# Altium schematic sheet Power.SchDoc
size A4
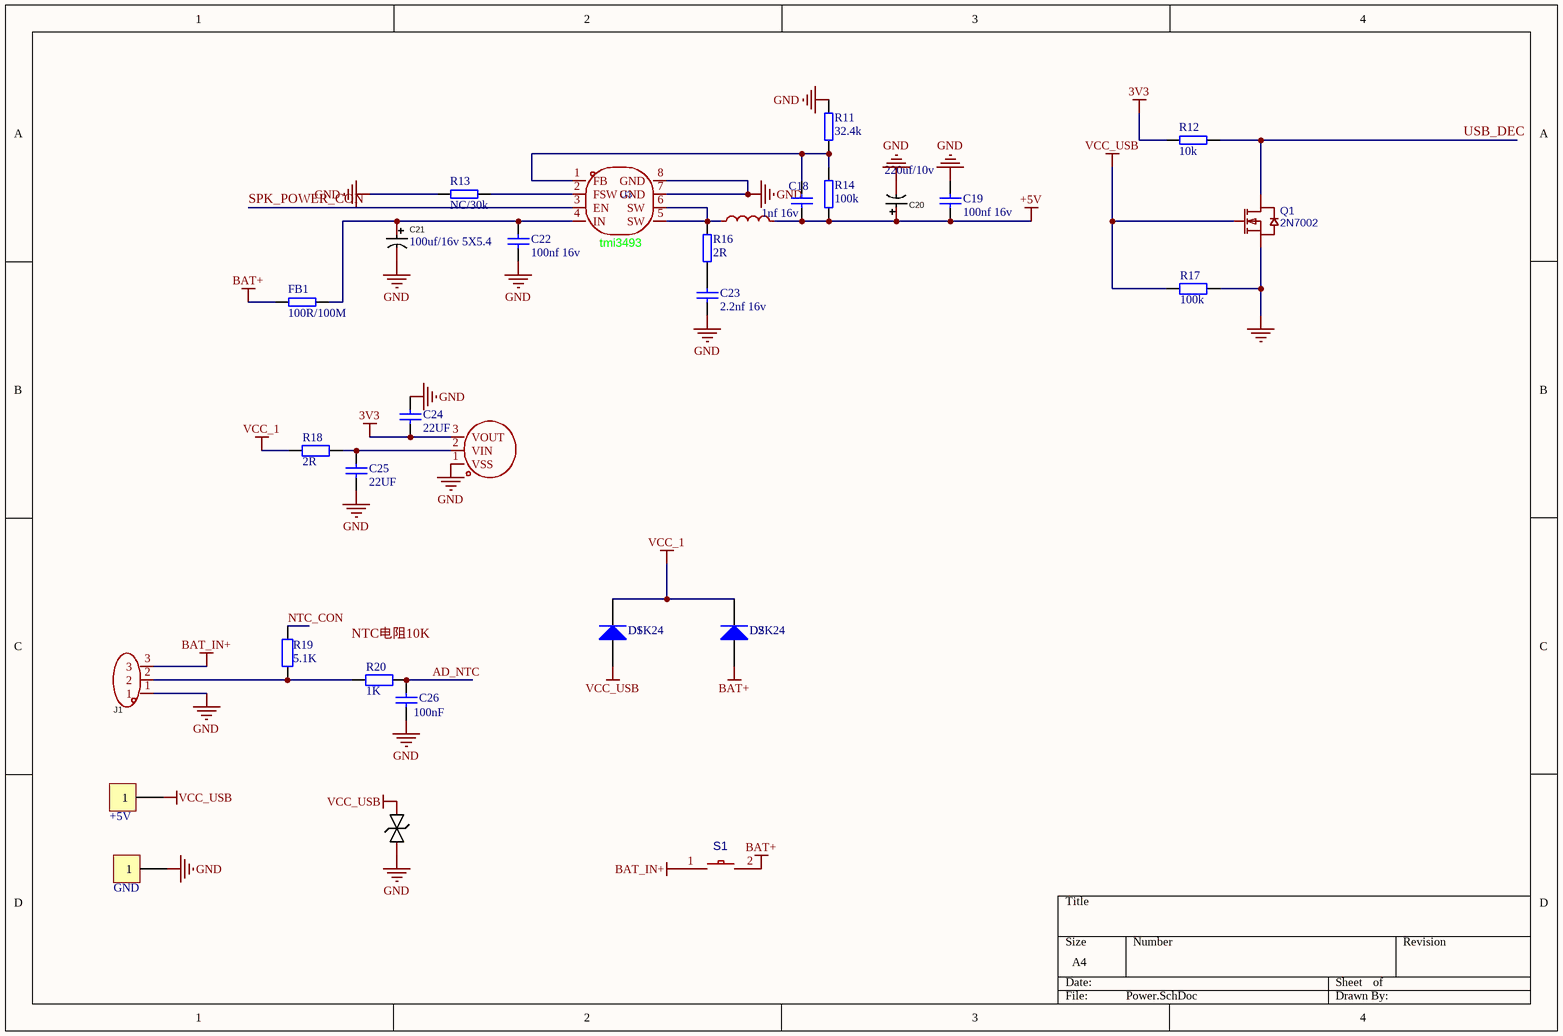
[diagram p0: Power.SchDoc]

## Parts
C18  1nf 16v  [0603_C]
C19  100nf 16v  [0603_C]
C20  220uf/10v  [SMD 6.3*7.7]
C21  100uf/16v 5X5.4  [CAP-SMD_5*5.4]
C22  100nf 16v  [0603_C]
C23  2.2nf 16v  [0603_C]
C24  22UF  [0805_C]
C25  22UF  [0805_C]
C26  100nF  [0603_C]
D1  DSK24  [SOD-123FL]
D2  DSK24  [SOD-123FL]
D3  SMF6.0CA  [SOD-123 双向]  (value not drawn)
FB1  100R/100M  [0805_R]
J1  3.96-3P LT  [CONN-SMD_3.96-3P-LT]  (value not drawn)
L3  33uh 0650  [IND-SMD_L7.7-W6.6_APS0650]  (value not drawn)
P1  +5V  [PAD2]
P2  GND  [PAD2]
Q1  2N7002  [SOT-23]
R11  32.4k  [0603_R]
R12  10k  [0603_R]
R13  NC/30k  [0603_R]
R14  100k  [0603_R]
R16  2R  [0603_R]
R17  100k  [0603_r]
R18  2R  [0805_R]
R19  5.1K  [0603_R]
R20  1K  [0603_R]
S1  *  [大按键]  (value not drawn)
U3  tmi3493  [SOP8]
U4  HT7333-1-MS  [SOT-89]  (value not drawn)

## Nets
3V3: C24.1 R12.1 U4.3(VOUT)
+5V: C18.1 C19.1 C20.1 L3.2 R14.2
BAT+: D2.1(A) FB1.2 S1.2
BAT_IN+: J1.3 S1.1
GND: C19.2 C20.2 C21.2 C22.2 C23.2 C24.2 C25.1 C26.1 D3.1 J1.1 P2.1 Q1.2(S) R11.1 R13.2 R17.1 U3.7(GND) U3.8(GND) U4.1(VSS)
VCC_1: D1.2(K) D2.2(K) R18.1
VCC_USB: D1.1(A) D3.2 P1.1 Q1.1(G) R17.2
AD_NTC: C26.2 R20.2
NTC_CON: R19.1
SPK_POWER_CON: U3.3(EN)
USB_DEC: Q1.3(D) R12.2
NetC18_2: C18.2 R11.2 R14.1 U3.1(FB)
NetC21_1: C21.1 C22.1 FB1.1 U3.4(IN)
NetC23_1: C23.1 R16.2
NetC25_2: C25.2 R18.2 U4.2(VIN)
NetJ1_2: J1.2 R19.2 R20.1
NetL3_1: L3.1 R16.1 U3.5(SW) U3.6(SW)
NetR13_1: R13.1 U3.2(FSW)

## Notes on the sheet
- Labels drawn without touching a wire or pin: NTC电阻10K

## Library data of the parts
C18 C19 C22 C23 = Cap: Capacitor; Value: 10nF; Published: 8-Jun-2000; Revision: July-2002: Re-released for DXP Platform.; Publisher: Altium Limited
C20 C21 = RVT1A221M0605_C72494: Symbol: RVT1A221M0605-C72494; Value: 220uF; Add into BOM: yes; Rated Voltage: 10V; Ripple Current: 90mA@120Hz; L: 5.4mm; Device: RVT1A221M0605_C72494; Supplier: LCSC; Manufacturer Part: RVT1A221M0605; Supplier Part: C72494; JLCPCB Part Class: Extended Part; Supplier Footprint: SMD,D6.3xL5.4mm; Datasheet: https://atta.szlcsc.com/upload/public/pdf/source/20170325/1490427950282.pdf; Convert to PCB: yes; Equivalent Series Resistance(ESR): -
C24-C26 = CAP
D1 D2 = Diode 1N4148: High Conductance Fast Diode; Published: 8-Jun-2000; LatestRevisionDate: 17-Jul-2002; LatestRevisionNote: Re-released for DXP Platform.; DatasheetVersion: 1997; PackageReference: DO-35; Publisher: Altium Limited; PackageDescription: Diode, Axial; Body 3.8 x 1.9 mm (LxDia. max), Lead Dia. 0.53 mm (max); Code_JEDEC: DO-204-AH; ComponentLink1Description: Manufacturer Link; ComponentLink1URL: http://www.fairchildsemi.com/; ComponentLink2Description: Datasheet; ComponentLink2URL: http://www.fairchildsemi.com/ds/1N%2F1N4148.pdf
D3 = SMF5.0CA_C726939: Add into BOM: yes; Symbol: SMF5.0CA_C726939; Device: SMF5.0CA_C726939; Supplier: LCSC; Supplier Part: C726939; Manufacturer Part: SMF5.0CA; JLCPCB Part Class: Extended Part; LCSC Part Name: SMF5.0CA; Supplier Footprint: SOD-123FL; Datasheet: https://atta.szlcsc.com/upload/public/pdf/source/20200825/C726891_B615A55314C94A3B16B7FBCD32D40567.pdf; Convert to PCB: yes
FB1 R11-R14 R16 = RES
J1 = BX-PH2.0-3PZZ: Add into BOM: yes; Pins Structure: 1x3P; Pitch: 2mm; Reference Series: PH; Number of PINs Per Row: 3; Current Rating (Max): 2A; Symbol: BX-PH2.0-3PZZ; Device: BX-PH2.0-3PZZ; LCSC Part Name: BX-PH2.0-3PZZ; Supplier Part: C18077745; Manufacturer Part: BX-PH2.0-3PZZ; JLCPCB Part Class: Extended Part; Datasheet: https://atta.szlcsc.com/upload/public/pdf/source/20231017/78B49E88B01779D5C268ECAB29020769.pdf; Supplier: LCSC; Convert to PCB: yes; Number of Pins: 3P; Number of Rows: 1; Row Spacing: -; Comment_1: BX-PH2.0-3PZZ
L3 = yspi0518s-100m: AddInBom: yes; ModelId: 8cf4ba96105a43709c0ba3ecbf611559; ModelName: IND-SMD_L5.4-W5.2-H3.0; ModelTransform: 212.598,204.728,0,0,0,0,0,0,0; Value: 10uH; Current Rating: 2.5A; Current - Saturation(Isat): 3A; Symbol: YSPI0518S-100M; SupplierPart: C46595828; ManufacturerPart: YSPI0518S-100M; Supplier Footprint: SMD,5.4x5.2mm; Datasheet: https://item.szlcsc.com/datasheet/YSPI0518S-100M/48734898.html; Supplier: LCSC; ConvertToPcb: yes; FootprintName: IND-SMD_L5.4-W5.2
P1 P2 = CON1
Q1 = JMTL3400A: Contributor: LCSC; BOM_Supplier: LCSC; BOM_Supplier Part: C2890442; BOM_Manufacturer Part: JMTL3400A; BOM_JLCPCB Part Class: Extended Part; spicePre: Q; spiceSymbolName: JMTL3400A
R17-R20 = Res1: 贴片电阻
S1 = TS-3625SP-2P: Symbol: TS-3625SP-2P
U3 = tmi3493: AddInBom: yes; ModelId: 75c24a7891ee4dd6bdac16a7163ff87e; ModelName: SOP-8_L4.9-W3.9-P1.27-LS6.0-BL-1; ModelTransform: 192.913,236.22,0,0,0,0,-0.393,2.749,0; Voltage - Supply: 4.3V~36V; Output Current: 3A; Frequency - Switching: 75kHz~600kHz; Number of Outputs: 1; Quiescent Current: 1mA; Symbol: TMI3493; SupplierPart: C5160494; ManufacturerPart: TMI3493; Supplier Footprint: SOP-8; JLCPCB Part Class: Extended Part; Datasheet: https://item.szlcsc.com/datasheet/TMI3493/5806479.html; Supplier: LCSC; ConvertToPcb: yes; FootprintName: SOP-8_L4.9-W3.9-P1.27-LS6.0-BL; Output Voltage: -
U4 = me6210a30pg: AddInBom: yes; ModelId: 6db690b7897d4d18a30d90c1b89525ee; ModelName: SOT-89-3_L4.3-W2.5-H1.6-LS4.1-P1.50; ModelTransform: 161.417,169.291,0,180,0,0,-18.504,-0.005,0; Voltage - Supply: 18V; Output Voltage: 3V; Output Current: 500mA; standby current: 1.5uA; Number of Outputs: 1; Symbol: ME6210A30PG; LCSC Part Name: 3V 500mA 18V; SupplierPart: C98226; ManufacturerPart: ME6210A30PG; Supplier Footprint: SOT-89; JLCPCB Part Class: Extended Part; Datasheet: https://item.szlcsc.com/datasheet/ME6210A30PG/99435.html; Supplier: LCSC; ConvertToPcb: yes; FootprintName: SOT-89_L4.5-W2.5-P1.50-LS4.2-BR; Power Supply Rejection Ratio (PSRR): -; Noise: -